# EAGLE design v2_esp12-adapter (EAGLE 9.1.0)
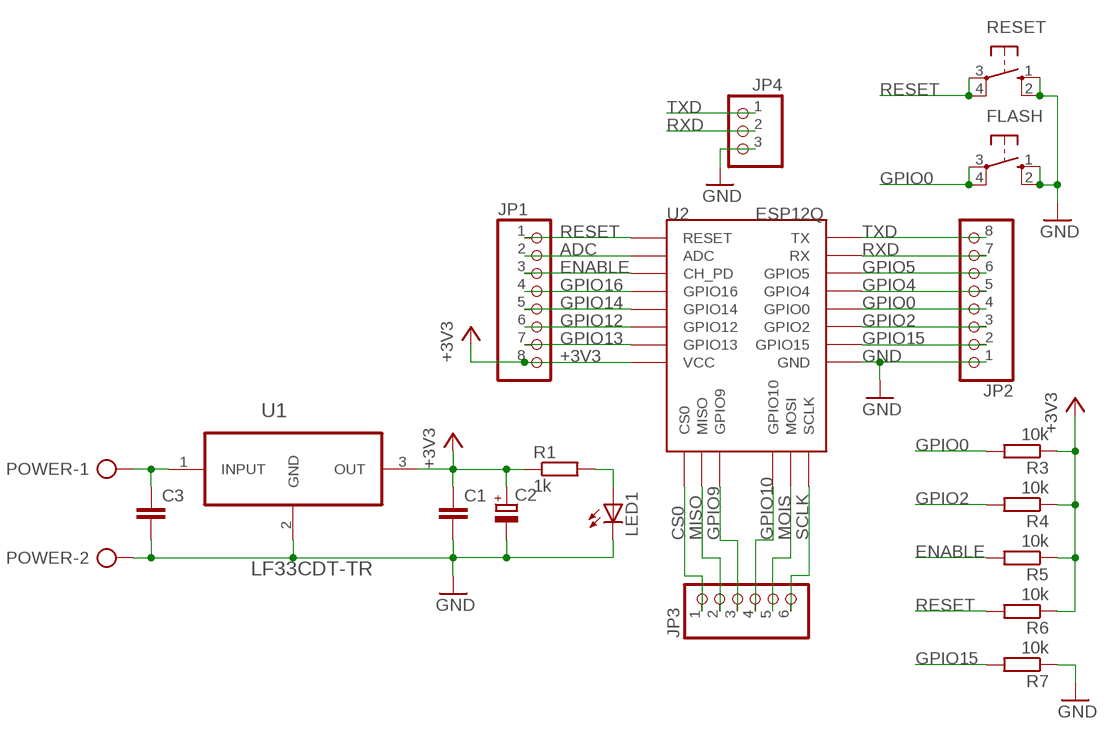
[diagram p0: schematic, sheet 1]

## Parts
C1  C-EU025-025X050  [C025-025X050]
C2  CPOL-EUE2,5-6E  [E2,5-6E]
C3  C-EU025-025X050  [C025-025X050]
FLASH  10-XX  [B3F-10XX]
JP1  PINHD-1X8  [1X08]
JP2  PINHD-1X8  [1X08]
JP3  PINHD-1X6  [1X06]
JP4  PINHD-1X3/90  [1X03/90]
LED1  LED5MM  [LED5MM]
POWER  AK300/2  [AK300/2]
R1  1k  R-EU_R1206  [R1206]
R3  10k  R-EU_R1206  [R1206]
R4  10k  R-EU_R1206  [R1206]
R5  10k  R-EU_R1206  [R1206]
R6  10k  R-EU_R1206  [R1206]
R7  10k  R-EU_R1206  [R1206]
RESET  10-XX  [B3F-10XX]
U1  LF33CDT-TR  [TO228P972X240-3N]
U2  ESP12Q  [ESP12Q]

## Nets
+3V3: C1.1 C2.+ JP1.8 R1.1 R3.1 R4.1 R5.1 R6.1 U1.3(OUT) U2.VCC
ADC: JP1.2 U2.ADC
CS0: JP3.1 U2.CS0
ENABLE: JP1.3 R5.2 U2.CH_PD
GND: C1.2 C2.- C3.2 FLASH.1(S) FLASH.2(S1) JP2.1 JP4.3 LED1.K(C) POWER.2 R7.1 RESET.1(S) RESET.2(S1) U1.2(GND) U2.GND
GPIO0: FLASH.3(P) FLASH.4(P1) JP2.4 R3.2 U2.GPIO0
GPIO2: JP2.3 R4.2 U2.GPIO2
GPIO4: JP2.5 U2.GPIO5(GPIO4)
GPIO5: JP2.6 U2.GPIO4(GPIO5)
GPIO9: JP3.3 U2.GPIO9
GPIO10: JP3.4 U2.GPIO10
GPIO12: JP1.6 U2.GPIO12
GPIO13: JP1.7 U2.GPIO13
GPIO14: JP1.5 U2.GPIO14
GPIO15: JP2.2 R7.2 U2.GPIO15
GPIO16: JP1.4 U2.GPIO16
MISO: JP3.2 U2.MISO
MOIS: JP3.5 U2.MOSI
N$18: LED1.A R1.2
RESET: JP1.1 R6.2 RESET.3(P) RESET.4(P1) U2.RESET
RXD: JP2.7 JP4.2 U2.RX
SCLK: JP3.6 U2.SCLK
TXD: JP2.8 JP4.1 U2.TX
V+: C3.1 POWER.1 U1.1(INPUT)

## Library data of the parts
C1 C3 = rcl:C-EU: CAPACITOR, European symbol; SPICEPREFIX: C
C2 = rcl:CPOL-EU: POLARIZED CAPACITOR, European symbol; SPICEPREFIX: C
FLASH RESET = switch-omron:10-XX: OMRON SWITCH; MPN: B3F-1000; OC_FARNELL: 176432; OC_NEWARK: 36M3542
JP1 JP2 = pinhead:PINHD-1X8: PIN HEADER
JP3 = pinhead:PINHD-1X6: PIN HEADER
JP4 = pinhead:PINHD-1X3: PIN HEADER
LED1 = led:LED: LED OSRAM: - CHIPLED LG R971, LG N971, LY N971, LG Q971, LY Q971, LO R971, LY R971 LH N974, LH R974 LS Q976, LO Q976, LY Q976 LO Q996 - Hyper CHIPLED LW Q18S LB Q993, LB Q99A, LB R99A - SideLED LS A670, LO A670, LY A670, LG A670, LP A670 LB A673, LV A673, LT A673, LW A673 LH A674 LY A675 LS A676, LA A676, LO A676, LY A676, LW A676 LS A679, LY A679, LG A679 - Hyper Micro SIDELED® LS Y876, LA Y876, LO Y876, LY Y876 LT Y87S - SmartLED LW L88C, LW L88S LB L89C, LB L89S, LG L890 LS L89K, LO L89K, LY L89K LS L896, LA L896, LO L896, LY L896 - TOPLED LS T670, LO T670, LY T670, LG T670, LP T670 LSG T670, LSP T670, LSY T670, LOP T670, LYG T670 LG T671, LOG T671, LSG T671 LB T673, LV T673, LT T673, LW T673 LH T674 LS T676, LA T676, LO T676, LY T676, LB T676, LH T676, LSB T676, LW T676 LB T67C, LV T67C, LT T67C, LS T67K, LO T67K, LY T67K, LW E67C LS E67B, LA E67B, LO E67B, LY E67B, LB E67C, LV E67C, LT E67C LW T67C LS T679, LY T679, LG T679 LS T770, LO T770, LY T770, LG T770, LP T770 LB T773, LV T773, LT T773, LW T773 LH T774 LS E675, LA E675, LY E675, LS T675 LS T776, LA T776, LO T776, LY T776, LB T776 LHGB T686 LT T68C, LB T68C - Hyper Mini TOPLED® LB M676 - Mini TOPLED Santana® LG M470 LS M47K, LO M47K, LY M47K Source: http://www.osram.convergy.de LUXEON: - LUMILED® LXK2-PW12-R00, LXK2-PW12-S00, LXK2-PW14-U00, LXK2-PW14-V00 LXK2-PM12-R00, LXK2-PM12-S00, LXK2-PM14-U00 LXK2-PE12-Q00, LXK2-PE12-R00, LXK2-PE12-S00, LXK2-PE14-T00, LXK2-PE14-U00 LXK2-PB12-K00, LXK2-PB12-L00, LXK2-PB12-M00, LXK2-PB14-N00, LXK2-PB14-P00, LXK2-PB14-Q00 LXK2-PR12-L00, LXK2-PR12-M00, LXK2-PR14-Q00, LXK2-PR14-R00 LXK2-PD12-Q00, LXK2-PD12-R00, LXK2-PD12-S00 LXK2-PH12-R00, LXK2-PH12-S00 LXK2-PL12-P00, LXK2-PL12-Q00, LXK2-PL12-R00 Source: www.luxeon.com KINGBRIGHT: KA-3528ASYC Source: www.kingbright.com
POWER = con-ptr500:AK300/2: CONNECTOR; OC_FARNELL: unknown; OC_NEWARK: unknown
R1 R3-R7 = rcl:R-EU_: RESISTOR, European symbol; SPICEPREFIX: R
U1 = LF33CDT-TR:LF33CDT-TR: LDO, 0.45VDO, 1A, 3.3V, 1%, 3TO252; AVAILABILITY: Unavailable; DESCRIPTION: LFXX Series 500 mA 3.3 V Fixed VLDO Voltage Regulator with Inhibit - TO-252; MF: STMicroelectronics; MP: LF33CDT-TR; PACKAGE: TO-252-3 STMicroelectronics; PRICE: None
U2 = esp826612q:ESP12Q: ESP8266 Wifi module 12-Q

## Board
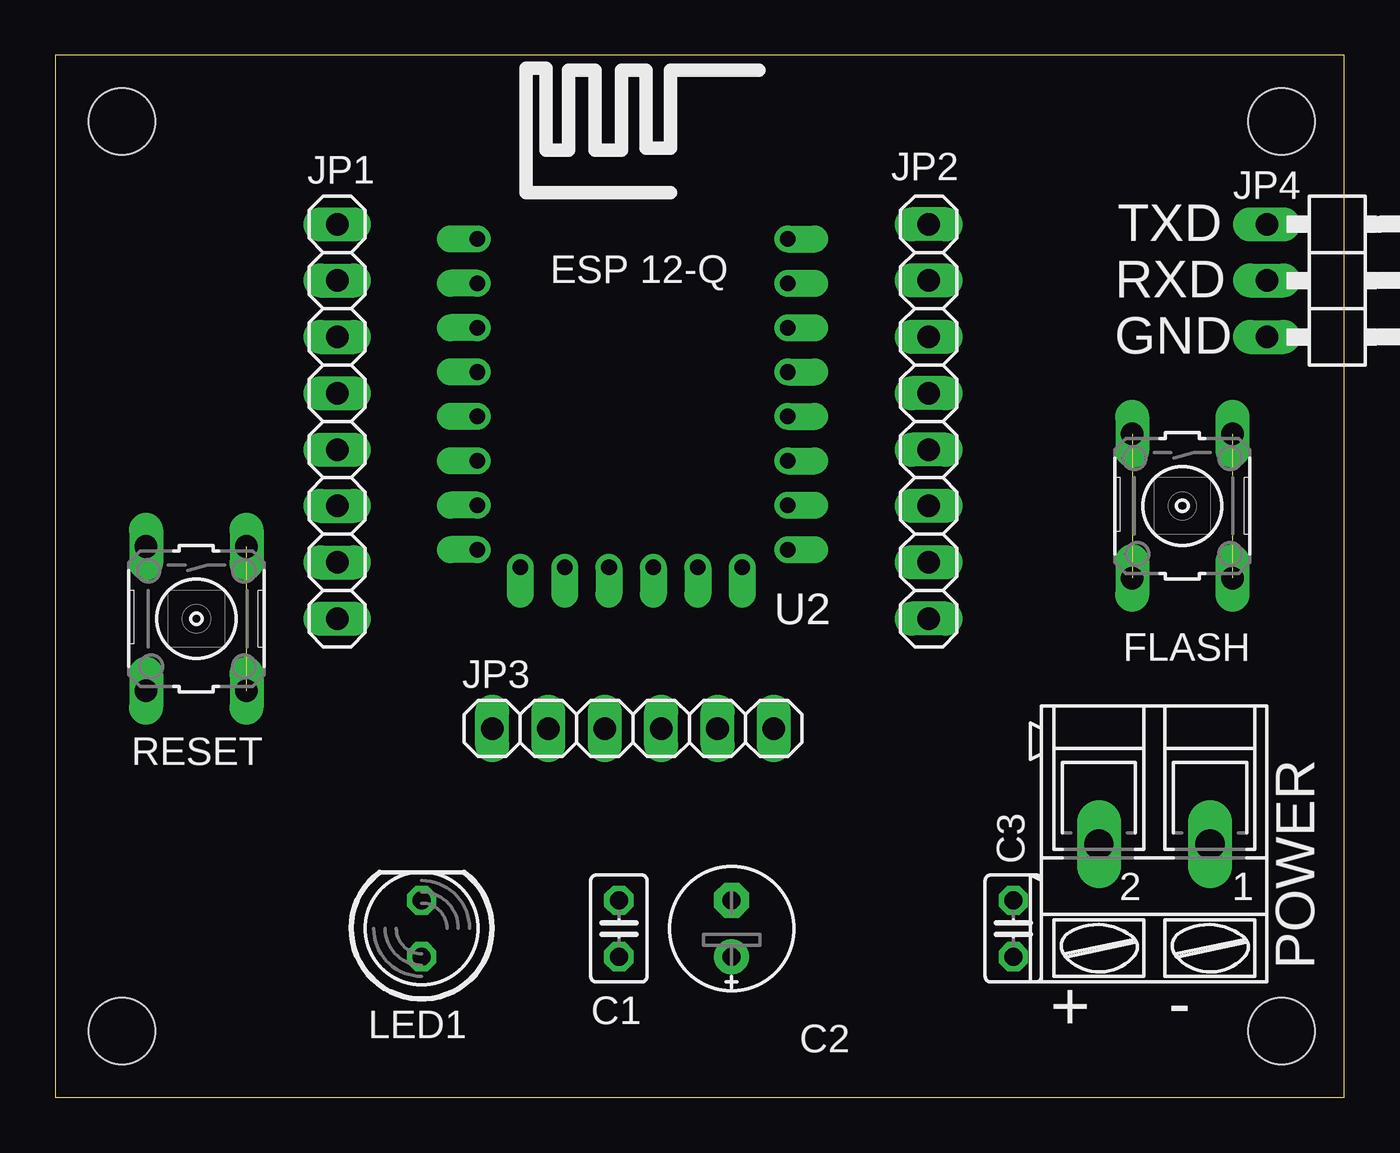
[diagram p1: board, top side]
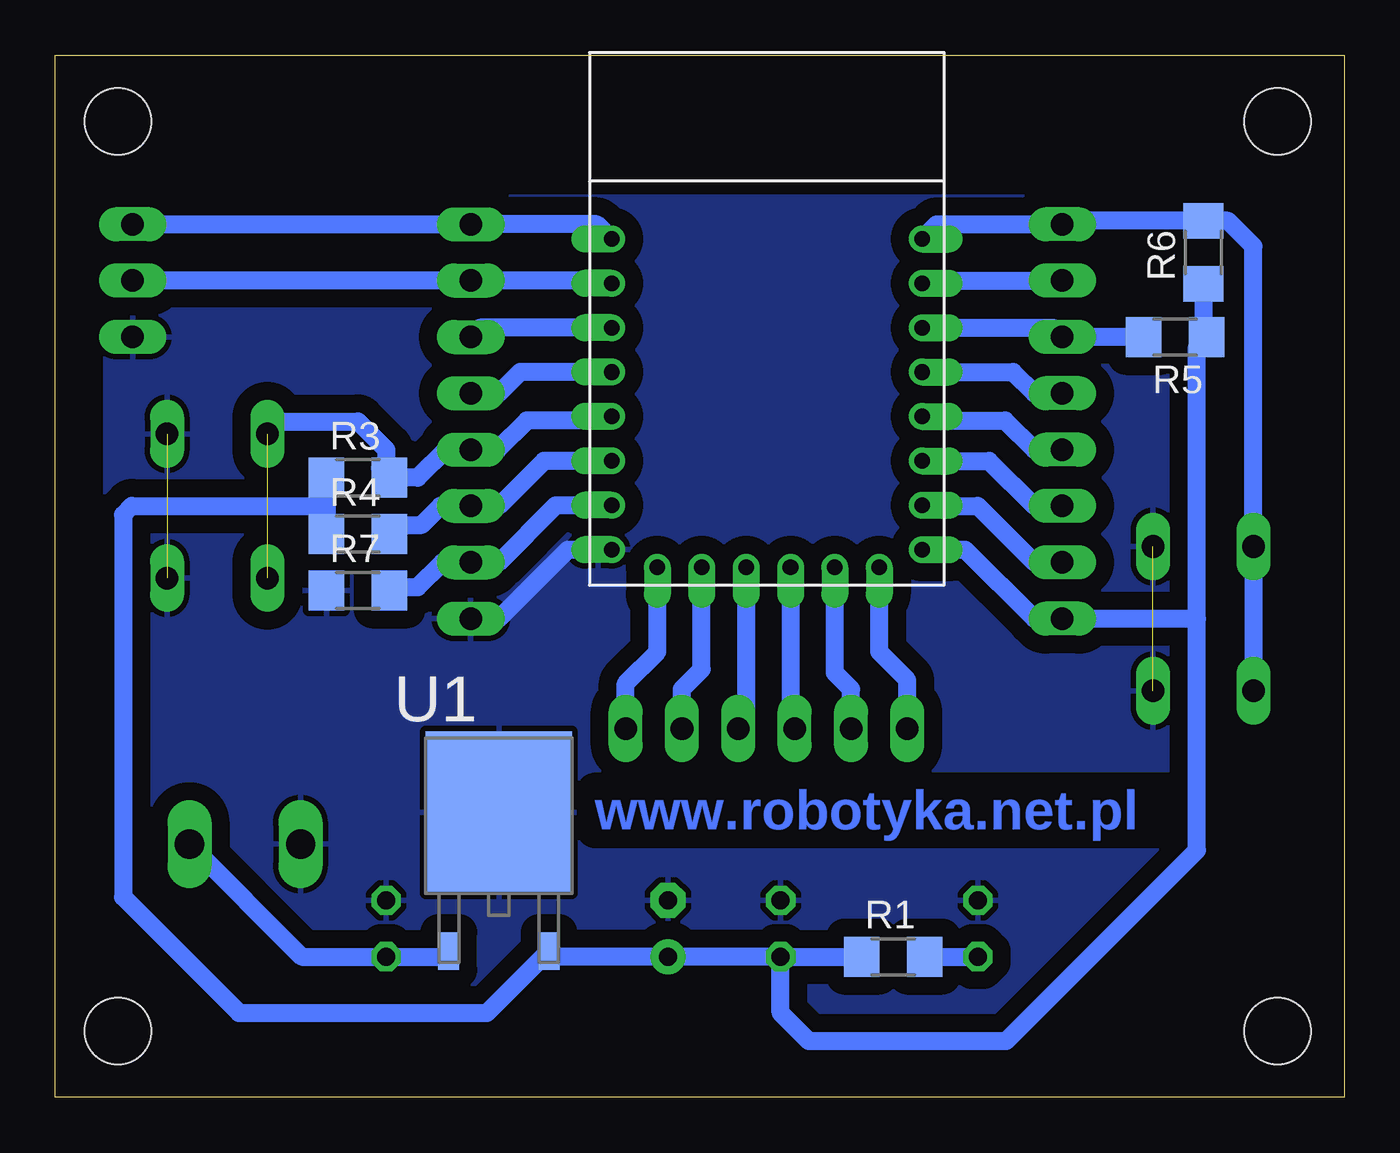
[diagram p2: board, bottom side, seen from below]

Size 58.09 x 46.98 mm. Coordinates in mm from the lower left corner, seen from the top.
Outline: 0,0 58.09,0 58.09,46.98 0,46.98 0,0
Copper layers (1*16): Top 0.035mm / dielectric 1.5mm / Bottom 0.035mm
Design rules "default *": minimum track width 6mil, minimum drill 0.35mm, track to track 32mil, track to pad 32mil, pad to pad 6mil, via to via 6mil, smd to smd 6mil, copper to edge 40mil, drill to drill 6mil, minimum pad ring 10mil, minimum via ring 8mil, stop-mask expansion 4mil, vias tented up to drill 0mil, thermal gap 10mil
Holes 3 mm at 3,3 3,44 55.27,44 55.27,3

### Footprints (pad centres in the part's own frame; a part is rotated, then mirrored left to right if it is on the bottom)
C025-025X050 = drill 0.813 octagon: 1 -1.27,0; 2 1.27,0
E2,5-6E = drill 0.813 pad 1.575: + -1.27,0 | drill 0.813 pad 1.575 octagon: - 1.27,0
B3F-10XX = drill 1.016 long: 1 -3.251,2.261; 2 3.251,2.261; 3 -3.251,-2.261; 4 3.251,-2.261
1X08 = drill 1.016 long: 1 -8.89,0; 2 -6.35,0; 3 -3.81,0; 4 -1.27,0; 5 1.27,0; 6 3.81,0; 7 6.35,0; 8 8.89,0
1X06 = drill 1.016 long: 1 -6.35,0; 2 -3.81,0; 3 -1.27,0; 4 1.27,0; 5 3.81,0; 6 6.35,0
1X03/90 = drill 1.016 long: 1 -2.54,-3.81; 2 0,-3.81; 3 2.54,-3.81
LED5MM = drill 0.813 octagon: A -1.27,0; K 1.27,0
AK300/2 = drill 1.321 long: 1 -2.515,0; 2 2.489,0
R1206 = smd 1.6 x 1.803: 1 -1.422,0; 2 1.422,0
TO228P972X240-3N = smd 0.94 x 1.702: 1 -2.261,-6.096; 3 2.261,-6.096 | smd 6.604 x 7.315: 2 0,0.152
ESP12Q = drill 0.7 offset: ADC -7.1,3.8; CH_PD -7.1,1.8; CS0 -5.165,-9.005; GND 6.9,-8.2; GPIO0 6.9,-2.2; GPIO2 6.9,-4.2; GPIO4 6.9,1.8; GPIO5 6.9,-0.2; GPIO9 -1.165,-9.005; GPIO10 0.835,-9.005; GPIO12 -7.1,-4.2; GPIO13 -7.1,-6.2; GPIO14 -7.1,-2.2; GPIO15 6.9,-6.2; GPIO16 -7.1,-0.2; MISO -3.165,-9.005; MOSI 2.835,-9.005; RESET -7.1,5.8; RX 6.9,3.8; SCLK 4.835,-9.005; TX 6.9,5.8; VCC -7.1,-8.2

### Placement (x,y rotation side)
C1  25.4,7.62 90 top
C2  30.48,7.62 90 top
C3  43.18,7.62 90 top
FLASH  50.8,26.67 270 top
JP1  12.7,30.48 270 top
JP2  39.37,30.48 90 top
JP3  26.04,16.64 0 top
JP4  58.42,36.83 270 top
LED1  16.51,7.62 90 top
POWER  49.53,11.43 180 top
R1  20.32,6.35 0 bottom
R3  44.45,27.94 0 bottom
R4  44.45,25.4 0 bottom
R5  7.62,34.29 180 bottom
R6  6.35,38.1 90 bottom
R7  44.45,22.86 0 bottom
RESET  6.35,21.59 270 top
U1  38.1,12.7 0 bottom
U2  26.12,32.91 0 top

### Tracks (layer width: path | path; a pad name or v marks a point on that pad's centre or on a via)
+3V3
  Bottom 0.813: R3.1 45.87,26.67 | 45.87,26.67 R4.1 | 45.87,26.67 54.64,26.67 55.04,26.27 55.04,9.04 49.81,3.81 38.63,3.81 U1.3 35.84,6.35 33.02,6.35 C2.+ C1.1 | C1.1 25.4,3.81 24.13,2.54 15.24,2.54 6.63,11.15 6.63,21.59 | 6.63,21.59 6.63,33.86 R5.1 6.35,34.44 R6.1 | C1.1 R1.1 | U2.VCC 17.09,24.7 13.97,21.59 JP1.8 6.63,21.59
ADC
  Bottom 0.813: U2.ADC 18.89,36.83 JP1.2
CS0
  Bottom 0.813: JP3.1 19.68,18.82 20.95,20.09 U2.CS0
ENABLE
  Bottom 0.813: U2.CH_PD 13.12,34.7 JP1.3 R5.2
GND  (2 unrouted)
  Bottom 0.813: JP2.1 38.1,21.59 34.98,24.7 U2.GND
  pour Bottom: 0,40.64 55.88,40.64 55.88,2.54 0,2.54
GPIO0  (1 unrouted)
  Bottom 0.813: U2.GPIO0 33.2,30.53 36.83,30.53 38.15,29.21 JP2.4 40.49,29.21 41.76,27.94 R3.2 | 43.46,28.37 R3.2 | FLASH.3 47.98,30.48 44.45,30.48 43.18,29.21 43.18,28.09 R3.2
GPIO2
  Bottom 0.813: U2.GPIO2 36.06,28.7 38.1,26.67 JP2.3 40.73,26.67 41.58,25.82 42.61,25.82 R4.2
GPIO4
  Bottom 0.813: U2.GPIO5 37.15,32.7 38.1,31.75 JP2.5
GPIO5
  Bottom 0.813: U2.GPIO4 38.95,34.7 JP2.6
GPIO9
  Bottom 0.813: U2.GPIO9 24.95,16.83 JP3.3
GPIO10
  Bottom 0.813: U2.GPIO10 26.95,16.99 JP3.4
GPIO12
  Bottom 0.813: U2.GPIO12 16,28.7 13.97,26.67 JP1.6
GPIO13
  Bottom 0.813: U2.GPIO13 18.98,26.67 16.51,26.67 13.97,24.13 JP1.7
GPIO14
  Bottom 0.813: U2.GPIO14 18.84,30.53 15.29,30.53 13.97,29.21 JP1.5
GPIO15
  Bottom 0.813: U2.GPIO15 35.52,26.7 38.1,24.13 JP2.2 40.64,24.13 41.76,23.01 42.88,23.01 R7.2
GPIO16
  Bottom 0.813: U2.GPIO16 14.93,32.7 13.97,31.75 JP1.4
MISO
  Bottom 0.813: JP3.2 22.23,18.41 22.95,19.14 U2.MISO
MOIS
  Bottom 0.813: JP3.5 29.84,18.41 28.95,19.3 U2.MOSI
N$18
  Bottom 0.813: R1.2 LED1.A
RESET
  Bottom 0.813: U2.RESET 18.36,39.37 JP1.1 12.55,39.52 R6.2 5.23,39.52 4.09,38.38 RESET.3 RESET.4
RXD
  Bottom 0.813: U2.RX 33.15,36.83 JP2.7 JP4.2
SCLK
  Bottom 0.813: JP3.6 32.38,18.66 30.95,20.09 U2.SCLK
TXD
  Bottom 0.813: U2.TX 33.69,39.37 JP2.8 JP4.1
V+
  Bottom 0.813: U1.1 40.39,6.6 40.64,6.35 C3.1 46.99,6.35 52.05,11.4 POWER.1 52.07,11.46

### Text on the board
Bottom: www.robotyka.net.pl
tNames: TXD | RXD | GND | + | -